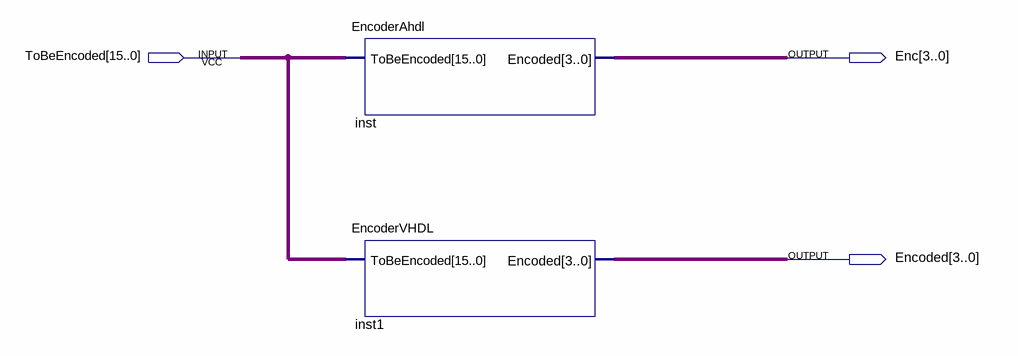
[diagram p0: schematic sheet]
// Quartus schematic ENCODER.bdf as structural Verilog: 2 symbols, 3 pins
module ENCODER (
  input  [15:0] ToBeEncoded,
  output [3:0] Enc,
  output [3:0] Encoded
);

  EncoderAhdl inst (.ToBeEncoded(ToBeEncoded), .Encoded(Enc));
  EncoderVHDL inst1 (.ToBeEncoded(ToBeEncoded), .Encoded(Encoded));
endmodule
